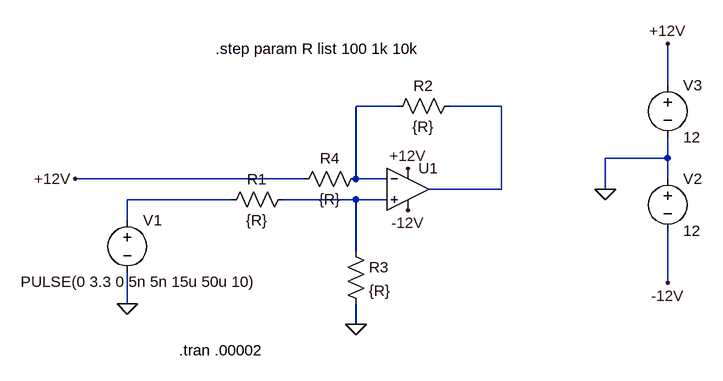
[diagram p0: schematic Draft1.asc]
Draft1.asc, the LTspice schematic file:
Version 4
SHEET 1 880 680
WIRE 720 144 720 80
WIRE 304 176 240 176
WIRE 464 176 384 176
WIRE 720 256 720 224
WIRE 720 256 624 256
WIRE 160 288 -192 288
WIRE 240 288 240 176
WIRE 288 288 240 288
WIRE 720 288 720 256
WIRE 464 304 464 176
WIRE 464 304 352 304
WIRE 624 304 624 256
WIRE 48 320 -112 320
WIRE 240 320 128 320
WIRE 288 320 240 320
WIRE -112 352 -112 320
WIRE 240 400 240 320
WIRE 720 448 720 368
WIRE -112 480 -112 432
WIRE 240 512 240 480
FLAG 240 512 0
FLAG -112 480 0
FLAG 720 448 -12V
FLAG 720 80 +12V
FLAG 624 304 0
FLAG 320 336 -12V
FLAG 320 272 +12V
FLAG -192 288 +12V
SYMBOL OpAmps/UniversalOpAmp2 320 304 R0
SYMATTR InstName U1
SYMATTR Value2 Avol=100K GBW=300Meg Slew=140Meg
SYMBOL voltage -112 336 R0
WINDOW 3 -164 110 Left 2
SYMATTR InstName V1
SYMATTR Value PULSE(0 3.3 0 5n 5n 15u 50u 10)
SYMBOL res 144 304 R90
WINDOW 0 0 56 VBottom 2
WINDOW 3 32 56 VTop 2
SYMATTR InstName R1
SYMATTR Value {R}
SYMBOL voltage 720 272 R0
SYMATTR InstName V2
SYMATTR Value 12
SYMBOL voltage 720 128 R0
SYMATTR InstName V3
SYMATTR Value 12
SYMBOL res 400 160 R90
WINDOW 0 0 56 VBottom 2
WINDOW 3 32 56 VTop 2
SYMATTR InstName R2
SYMATTR Value {R}
SYMBOL res 224 384 R0
SYMATTR InstName R3
SYMATTR Value {R}
SYMBOL res 256 272 R90
WINDOW 0 0 56 VBottom 2
WINDOW 3 32 56 VTop 2
SYMATTR InstName R4
SYMATTR Value {R}
TEXT -32 552 Left 2 !.tran .00002
TEXT 24 88 Left 2 !.step param R list 100 1k 10k

The netlist it stands for:
* Draft1.asc
XU1 N004 N001 +12V -12V N002 level2 Avol=100K GBW=300Meg Slew=140Meg Ilimit=25m Rail=0 Vos=0 En=0 Enk=0 In=0 Ink=0 Rin=500Meg  ; pins In+ In- V+ V- OUT
V1 N003 0 PULSE(0 3.3 0 5n 5n 15u 50u 10)
R1 N004 N003 {R}
V2 0 -12V 12
V3 +12V 0 12
R2 N002 N001 {R}
R3 N004 0 {R}
R4 N001 +12V {R}
.tran .00002
.step param R list 100 1k 10k
.lib UniversalOpAmp2.lib
.backanno
.end